# Altium schematic sheet Nixie_Embedded_Supply.SchDoc
size A4
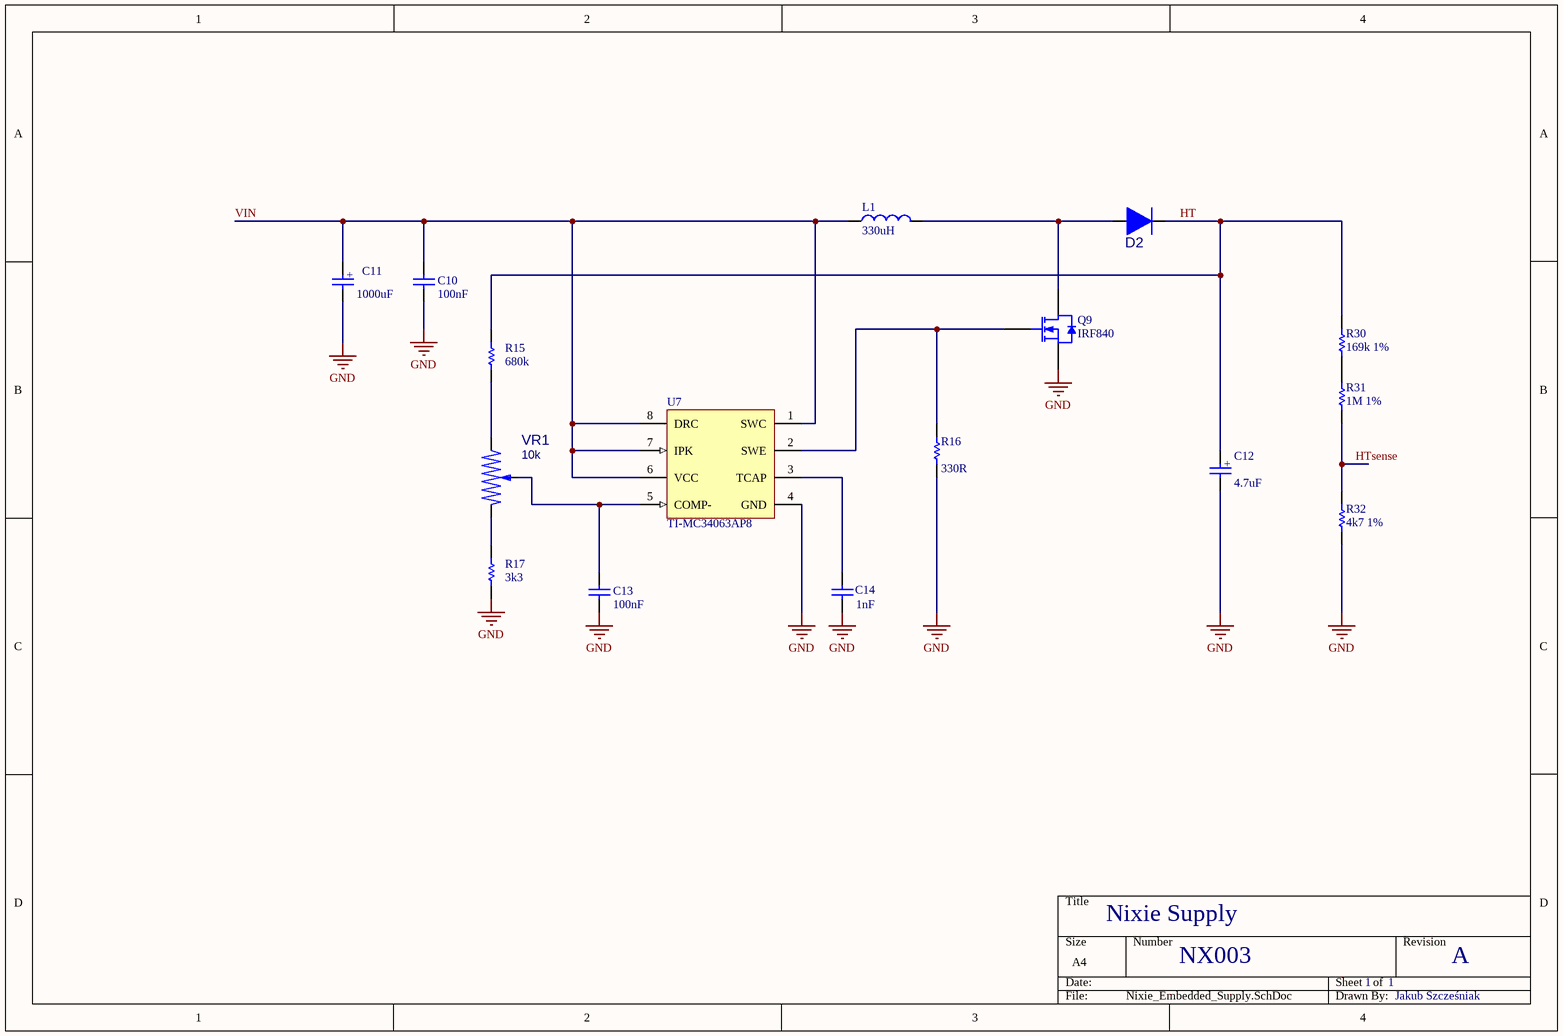
[diagram p0: Nixie_Embedded_Supply.SchDoc]

## Parts
C10  value 100nF  [CAPC0805(2012)100_M]  (hidden comment: CAP 100nF 16V 0805(2012))
C11  value 1000uF  [CAPsmd_rad10]  (hidden comment: CAP_rad16x10)
C12  value 4.7uF  [CAP_HV]  (hidden comment: CAP_HV)
C13  value 100nF  [CAPC0805(2012)100_M]  (hidden comment: CAP 100nF 16V 0805(2012))
C14  value 1nF  [CAPC0805(2012)100_M]  (hidden comment: CAP 1nF 25V 0805(2012))
D2  BYV29-400  [D2PAK]  (value not drawn)
L1  330uH  [Coil]
Q9  IRF840  [D2PAK]
R15  value 680k  [RESC0805(2012)_M]  (hidden comment: 680K 5% 0805(2012))
R16  value 330R  [RESC0805(2012)_M]  (hidden comment: 330R 5% 0805(2012))
R17  value 3k3  [RESC0805(2012)_M]  (hidden comment: 3K3 1% 0805(2012))
R30  169k 1%  [RESC0805(2012)_M]
R31  1M 1%  [RESC0805(2012)_M]
R32  4k7 1%  [RESC0805(2012)_M]
U7  TI-MC34063AP8  [SOIC8]
VR1  10k  [POT7x5]

## Nets
GND: C10.1 C11.2 C12.2 C13.1 C14.1 Q9.3(S) R16.1 R17.1 R32.1 U7.4(GND)
HT: C12.1 D2.2(K) R15.2 R30.2
HTsense: R31.1 R32.2
VIN: C10.2 C11.1 L1.1 U7.1(SWC) U7.6(VCC) U7.7(IPK) U7.8(DRC)
NetC13_2: C13.2 U7.5(COMP-) VR1.2
NetC14_2: C14.2 U7.3(TCAP)
NetD2_1: D2.1(A) L1.2 Q9.2(D)
NetQ9_1: Q9.1(G) R16.2 U7.2(SWE)
NetR15_1: R15.1 VR1.3
NetR17_2: R17.2 VR1.1
NetR30_1: R30.1 R31.2

## Notes on the sheet
- Nixie Supply
- NX003
- 1
- A
- Jakub Szcześniak
- (in symbol CAP_HV) +
- (in symbol CAP_rad16x10) +

## Library data of the parts
C10 C13 = CMP-1036-04400-1: CAP 100nF 16V ±5% 0805 (2012 Metric) Thickness 1mm SMD; Case-EIA: 0805; Case-Metric: 2012; Max Thickness: 1 mm; Tolerance: ±5%; Technology: SMT; Rated Voltage: 16 V
C14 = CMP-1036-02963-1: CAP 1nF 25V ±1% 0805 (2012 Metric) Thickness 1mm SMD; Case-EIA: 0805; Case-Metric: 2012; Rated Voltage: 25 V; Max Thickness: 1 mm; Technology: SMT; Tolerance: ±1%
D2 = BYV29-400: pin to pad: 1>3; Part Number: 104-5508; Supplier: Farnell
L1 = L
R15 = CMP-1013-00142-1: 680K 0.125W 5% 0805 (2012 Metric)  SMD; Case-EIA: 0805; Case-Metric: 2012; Power: 0.125 W; Technology: SMT; Tolerance: 5 %
R16 = CMP-1013-00062-1: 330R 0.125W 5% 0805 (2012 Metric)  SMD; Case-EIA: 0805; Case-Metric: 2012; Tolerance: 5 %; Power: 0.125 W; Technology: SMT
R17 = CMP-1013-00567-1: 3K3 0.125W 1% 0805 (2012 Metric)  SMD; Case-Metric: 2012; Case-EIA: 0805; Technology: SMT; Tolerance: 1 %; Power: 0.125 W
R30 = CMP-1013-00760-1: 169K 0.125W 1% 0805 (2012 Metric)  SMD; Case-Metric: 2012; Value: 169000.00 Ohm; Case-EIA: 0805; Power: 0.125 W; Technology: SMT; Tolerance: 1 %
R31 = CMP-1013-00849-1: 1M 0.125W 1% 0805 (2012 Metric)  SMD; Value: 1000000.00 Ohm; Case-Metric: 2012; Case-EIA: 0805; Technology: SMT; Power: 0.125 W; Tolerance: 1 %
R32 = CMP-1013-00586-1: 4K7 0.125W 1% 0805 (2012 Metric)  SMD; Case-Metric: 2012; Case-EIA: 0805; Value: 4700.00 Ohm; Technology: SMT; Power: 0.125 W; Tolerance: 1 %
VR1 = RESPOT_ST-V01: Potentiometer; Part Number: 119-1725; Supplier: Farnell